# Altium schematic sheet Circuit_2023-05-25.schdoc
size 276 x 214 mm
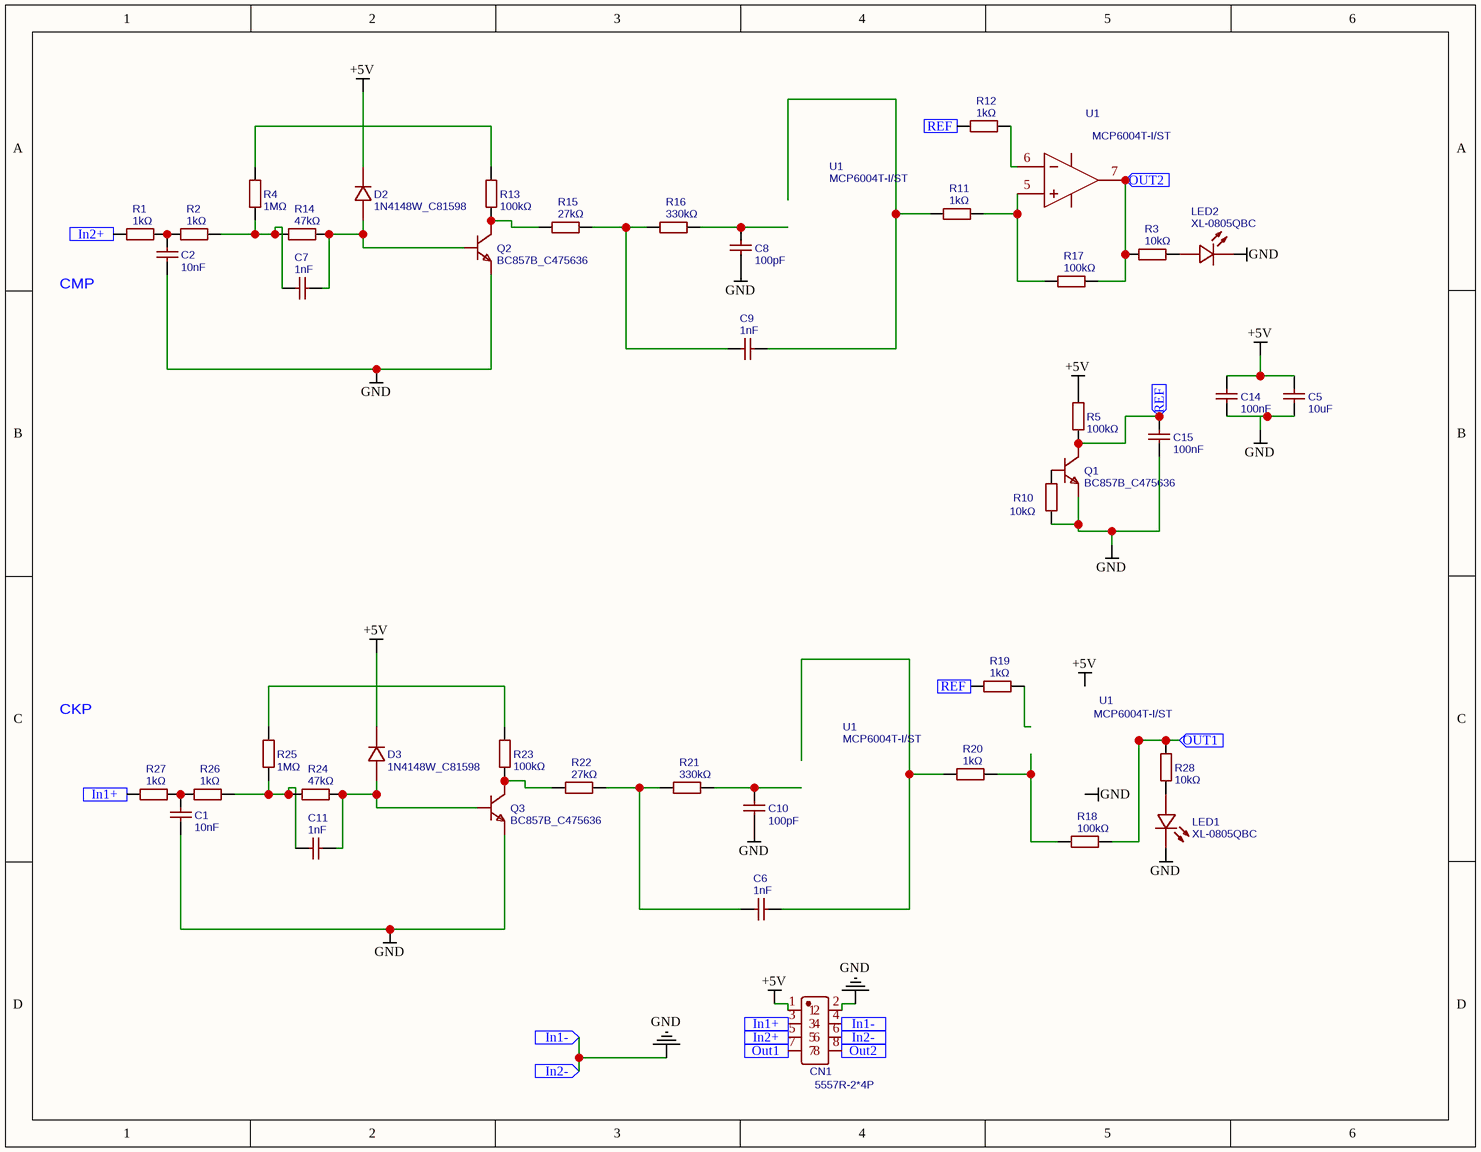
[diagram p0: Circuit_2023-05-25.schdoc]

## Parts
(Parts that share a designator on the sheet are numbered #1, #2 ... from top to bottom, then left to right.)
C1  10nF  [C0402]
C2  10nF  [C0402]
C5  10uF  [C0402]
C6  1nF  [C0402]
C7  1nF  [C0402]
C8  100pF  [C0402]
C9  1nF  [C0402]
C10  100pF  [C0402]
C11  1nF  [C0402]
C14  100nF  [C0402]
C15  100nF  [C0402]
CN1  5557R-2*4P  [CONN-TH_8P-P4.20_5557R-2X4P]
D2  1N4148W_C81598  [SOD-123F_L2.7-W1.6-LS3.8-RD]
D3  1N4148W_C81598  [SOD-123F_L2.7-W1.6-LS3.8-RD]
LED1  XL-0805QBC  [LED0805-RD]
LED2  XL-0805QBC  [LED0805-RD]
Q1  BC857B_C475636  [SOT-23-3_L2.9-W1.3-P1.90-LS2.4-BR]
Q2  BC857B_C475636  [SOT-23-3_L2.9-W1.3-P1.90-LS2.4-BR]
Q3  BC857B_C475636  [SOT-23-3_L2.9-W1.3-P1.90-LS2.4-BR]
R1  1kΩ  [R0402]
R2  1kΩ  [R0402]
R3  10kΩ  [R0402]
R4  1MΩ  [R0402]
R5  100kΩ  [R0402]
R10  10kΩ  [R0402]
R11  1kΩ  [R0402]
R12  1kΩ  [R0402]
R13  100kΩ  [R0402]
R14  47kΩ  [R0402]
R15  27kΩ  [R0402]
R16  330kΩ  [R0402]
R17  100kΩ  [R0402]
R18  100kΩ  [R0402]
R19  1kΩ  [R0402]
R20  1kΩ  [R0402]
R21  330kΩ  [R0402]
R22  27kΩ  [R0402]
R23  100kΩ  [R0402]
R24  47kΩ  [R0402]
R25  1MΩ  [R0402]
R26  1kΩ  [R0402]
R27  1kΩ  [R0402]
R28  10kΩ  [R0402]
U1#1  MCP6004T-I/ST  [TSSOP-14_L5.0-W4.4-P0.65-LS6.4-BL]
U1#2  MCP6004T-I/ST  [TSSOP-14_L5.0-W4.4-P0.65-LS6.4-BL]
U1#3  MCP6004T-I/ST  [TSSOP-14_L5.0-W4.4-P0.65-LS6.4-BL]
U1#4  MCP6004T-I/ST  [TSSOP-14_L5.0-W4.4-P0.65-LS6.4-BL]

## Ports
In1+ (in), In1- (in), In2+ (in), In2- (in), Out1 (in), OUT1 (in), Out2 (in), OUT2 (in), REF (in)

## Nets
+5V: C5.2 C14.2 CN1.1 D2.1(K) D3.1(K) R5.2
GND: C1.1 C2.1 C5.1 C8.1 C10.1 C14.1 C15.1 CN1.2 CN1.4 CN1.6 LED1.1(K) LED2.1(K) Q1.2(E) Q2.2(E) Q3.2(E) R10.2 ; port In1-, port In2-
In1+: CN1.3 R27.1 ; port In1+
In2+: CN1.5 R1.1 ; port In2+
Out1: CN1.7 R18.2 R28.1 ; port Out1, port OUT1
Out2: CN1.8 R3.1 R17.2 U1#1.7(VOUTB) ; port Out2, port OUT2
REF: C15.2 Q1.3(C) R5.1 R12.1 R19.1 ; port REF
NetC1_2: C1.2 R26.1 R27.2
NetC2_2: C2.2 R1.2 R2.1
NetC6_1: C6.1 R21.1 R22.2
NetC6_2: C6.2 R20.1
NetC7_1: C7.1 R2.2 R4.1 R14.1
NetC7_2: C7.2 D2.2(A) Q2.1(B) R14.2
NetC8_2: C8.2 R16.2
NetC9_1: C9.1 R15.2 R16.1
NetC9_2: C9.2 R11.1
NetC10_2: C10.2 R21.2
NetC11_1: C11.1 R24.1 R25.1 R26.2
NetC11_2: C11.2 D3.2(A) Q3.1(B) R24.2
NetLED1_2: LED1.2(A) R28.2
NetLED2_2: LED2.2(A) R3.2
NetQ1_1: Q1.1(B) R10.1
NetQ2_3: Q2.3(C) R13.1 R15.1
NetQ3_3: Q3.3(C) R22.1 R23.1
NetR4_2: R4.2 R13.2
NetR11_2: R11.2 R17.1 U1#1.5(VINB+)
NetR12_2: R12.2 U1#1.6(VINB-)
NetR18_1: R18.1 R20.2
NetR23_2: R23.2 R25.2

Not connected (* = marked no-connect by the designer): R19 2

## Notes on the sheet
- CMP
- CKP
- Labels drawn without touching a wire or pin: +5V, GND

## Library data of the parts
C1 C2 = 10nF: BOM_Manufacturer: FH(风华); BOM_Manufacturer Part: 0402B103K500NT; nameAlias: Capacitance; BOM_Supplier: LCSC; BOM_Supplier Part: C1524; BOM_JLCPCB Part Class: Extended Part; spicePre: C; spiceSymbolName: 0402B103K500NT
C5 = 10uF: BOM_Manufacturer Part: CL05A106MQ5NUNC; BOM_Manufacturer: SAMSUNG(三星); nameAlias: Capacitance; BOM_Supplier: LCSC; BOM_Supplier Part: C15525; BOM_JLCPCB Part Class: Basic Part; spicePre: C; spiceSymbolName: CL05A106MQ5NUNC
C6 C7 C9 C11 = 1nF: BOM_Manufacturer: FH(风华); BOM_Manufacturer Part: 0402B102K500NT; nameAlias: Capacitance; BOM_Supplier: LCSC; BOM_Supplier Part: C1523; BOM_JLCPCB Part Class: Basic Part; spicePre: C; spiceSymbolName: 0402B102K500NT
C8 C10 = 100pF: BOM_Manufacturer: FH(风华); BOM_Manufacturer Part: 0402CG101J500NT; nameAlias: Capacitance; BOM_Supplier: LCSC; BOM_Supplier Part: C1546; BOM_JLCPCB Part Class: Basic Part; spicePre: C; spiceSymbolName: 0402CG101J500NT
C14 C15 = 100nF: BOM_Manufacturer Part: CL05B104KO5NNNC; BOM_Manufacturer: SAMSUNG(三星); nameAlias: Capacitance; BOM_Supplier: LCSC; BOM_Supplier Part: C1525; BOM_JLCPCB Part Class: Basic Part; spicePre: C; spiceSymbolName: CL05B104KO5NNNC
CN1 = 5557R-2*4P: BOM_Manufacturer: Ckmtw(Shenzhen Cankemeng); Contributor: LCSC; BOM_Supplier: LCSC; BOM_Supplier Part: C477838; BOM_Manufacturer Part: 5557R-2*4P; BOM_JLCPCB Part Class: Extended Part; spicePre: C; spiceSymbolName: 5557R-2*4P
D2 D3 = 1N4148W_C81598: BOM_Manufacturer: ST(先科); BOM_Supplier: LCSC; BOM_Manufacturer Part: 1N4148W; BOM_Supplier Part: C81598; BOM_JLCPCB Part Class: Basic Part; spicePre: D; spiceSymbolName: 1N4148W_C81598
LED1 LED2 = XL-0805QBC: BOM_Manufacturer: KENTO; BOM_Supplier: LCSC; BOM_Manufacturer Part: XL-0805QBC; BOM_Supplier Part: C2293; BOM_JLCPCB Part Class: Basic Part; spicePre: L; spiceSymbolName: XL-0805QBC
Q1-Q3 = BC857B_C475636: BOM_Manufacturer: SHIKUES(时科); BOM_Manufacturer Part: BC857B; Contributor: LCSC; BOM_Supplier: LCSC; BOM_Supplier Part: C475636; BOM_JLCPCB Part Class: Extended Part; spicePre: Q; spiceSymbolName: BC857B_C475636
R1 R2 R11 R12 R19 R20 R26 R27 = 1kΩ: BOM_Manufacturer: UNI-ROYAL(厚声); BOM_Manufacturer Part: 0402WGF1001TCE; nameAlias: Resistance; Resistance (Ohms): 1K; BOM_Supplier: LCSC; BOM_Supplier Part: C11702; BOM_JLCPCB Part Class: Basic Part; spicePre: R; spiceSymbolName: 0402WGF1001TCE
R3 R10 R28 = 10kΩ: BOM_Manufacturer: UNI-ROYAL(厚声); BOM_Manufacturer Part: 0402WGF1002TCE; nameAlias: Resistance; Resistance (Ohms): 10K; BOM_Supplier: LCSC; BOM_Supplier Part: C25744; BOM_JLCPCB Part Class: Basic Part; spicePre: R; spiceSymbolName: 0402WGF1002TCE
R4 R25 = 1MΩ: BOM_Manufacturer: UNI-ROYAL(厚声); BOM_Manufacturer Part: 0402WGF1004TCE; nameAlias: Resistance; Resistance (Ohms): 1M; BOM_Supplier: LCSC; BOM_Supplier Part: C26083; BOM_JLCPCB Part Class: Basic Part; spicePre: R; spiceSymbolName: 0402WGF1004TCE
R5 R13 R17 R18 R23 = 100kΩ: BOM_Manufacturer: UNI-ROYAL(厚声); BOM_Manufacturer Part: 0402WGF1003TCE; nameAlias: Resistance; Resistance (Ohms): 100K; BOM_Supplier: LCSC; BOM_Supplier Part: C25741; BOM_JLCPCB Part Class: Basic Part; spicePre: R; spiceSymbolName: 0402WGF1003TCE
R14 R24 = 47kΩ: BOM_Manufacturer: UNI-ROYAL(厚声); BOM_Manufacturer Part: 0402WGF4702TCE; nameAlias: Resistance; Resistance (Ohms): 47K; BOM_Supplier: LCSC; BOM_Supplier Part: C25792; BOM_JLCPCB Part Class: Basic Part; spicePre: R; spiceSymbolName: 0402WGF4702TCE
R15 R22 = 27kΩ: BOM_Manufacturer: UNI-ROYAL(厚声); BOM_Manufacturer Part: 0402WGF2702TCE; nameAlias: Resistance; Resistance (Ohms): 27K; BOM_Supplier: LCSC; BOM_Supplier Part: C25771; BOM_JLCPCB Part Class: Basic Part; spicePre: R; spiceSymbolName: 0402WGF2702TCE
R16 R21 = 330kΩ: BOM_Manufacturer: UNI-ROYAL(厚声); BOM_Manufacturer Part: 0402WGF3303TCE; nameAlias: Resistance; Resistance (Ohms): 330K; BOM_Supplier: LCSC; BOM_Supplier Part: C25778; BOM_JLCPCB Part Class: Basic Part; spicePre: R; spiceSymbolName: 0402WGF3303TCE
U1#1-U1#4 = MCP6004T-I/ST: BOM_Manufacturer: MICROCHIP(美国微芯); subpart_no: 1; BOM_Supplier Part: C50282; BOM_Supplier: LCSC; BOM_Manufacturer Part: MCP6004T-I/ST; BOM_JLCPCB Part Class: Extended Part; spicePre: U; spiceSymbolName: MCP6004T-I/ST